# EAGLE design MINI_SAM_D51_013 (EAGLE 9.1.1)
BUILD: 2018/01; DESIGNER: BENJAMIN SHOCKLEY; REV: A
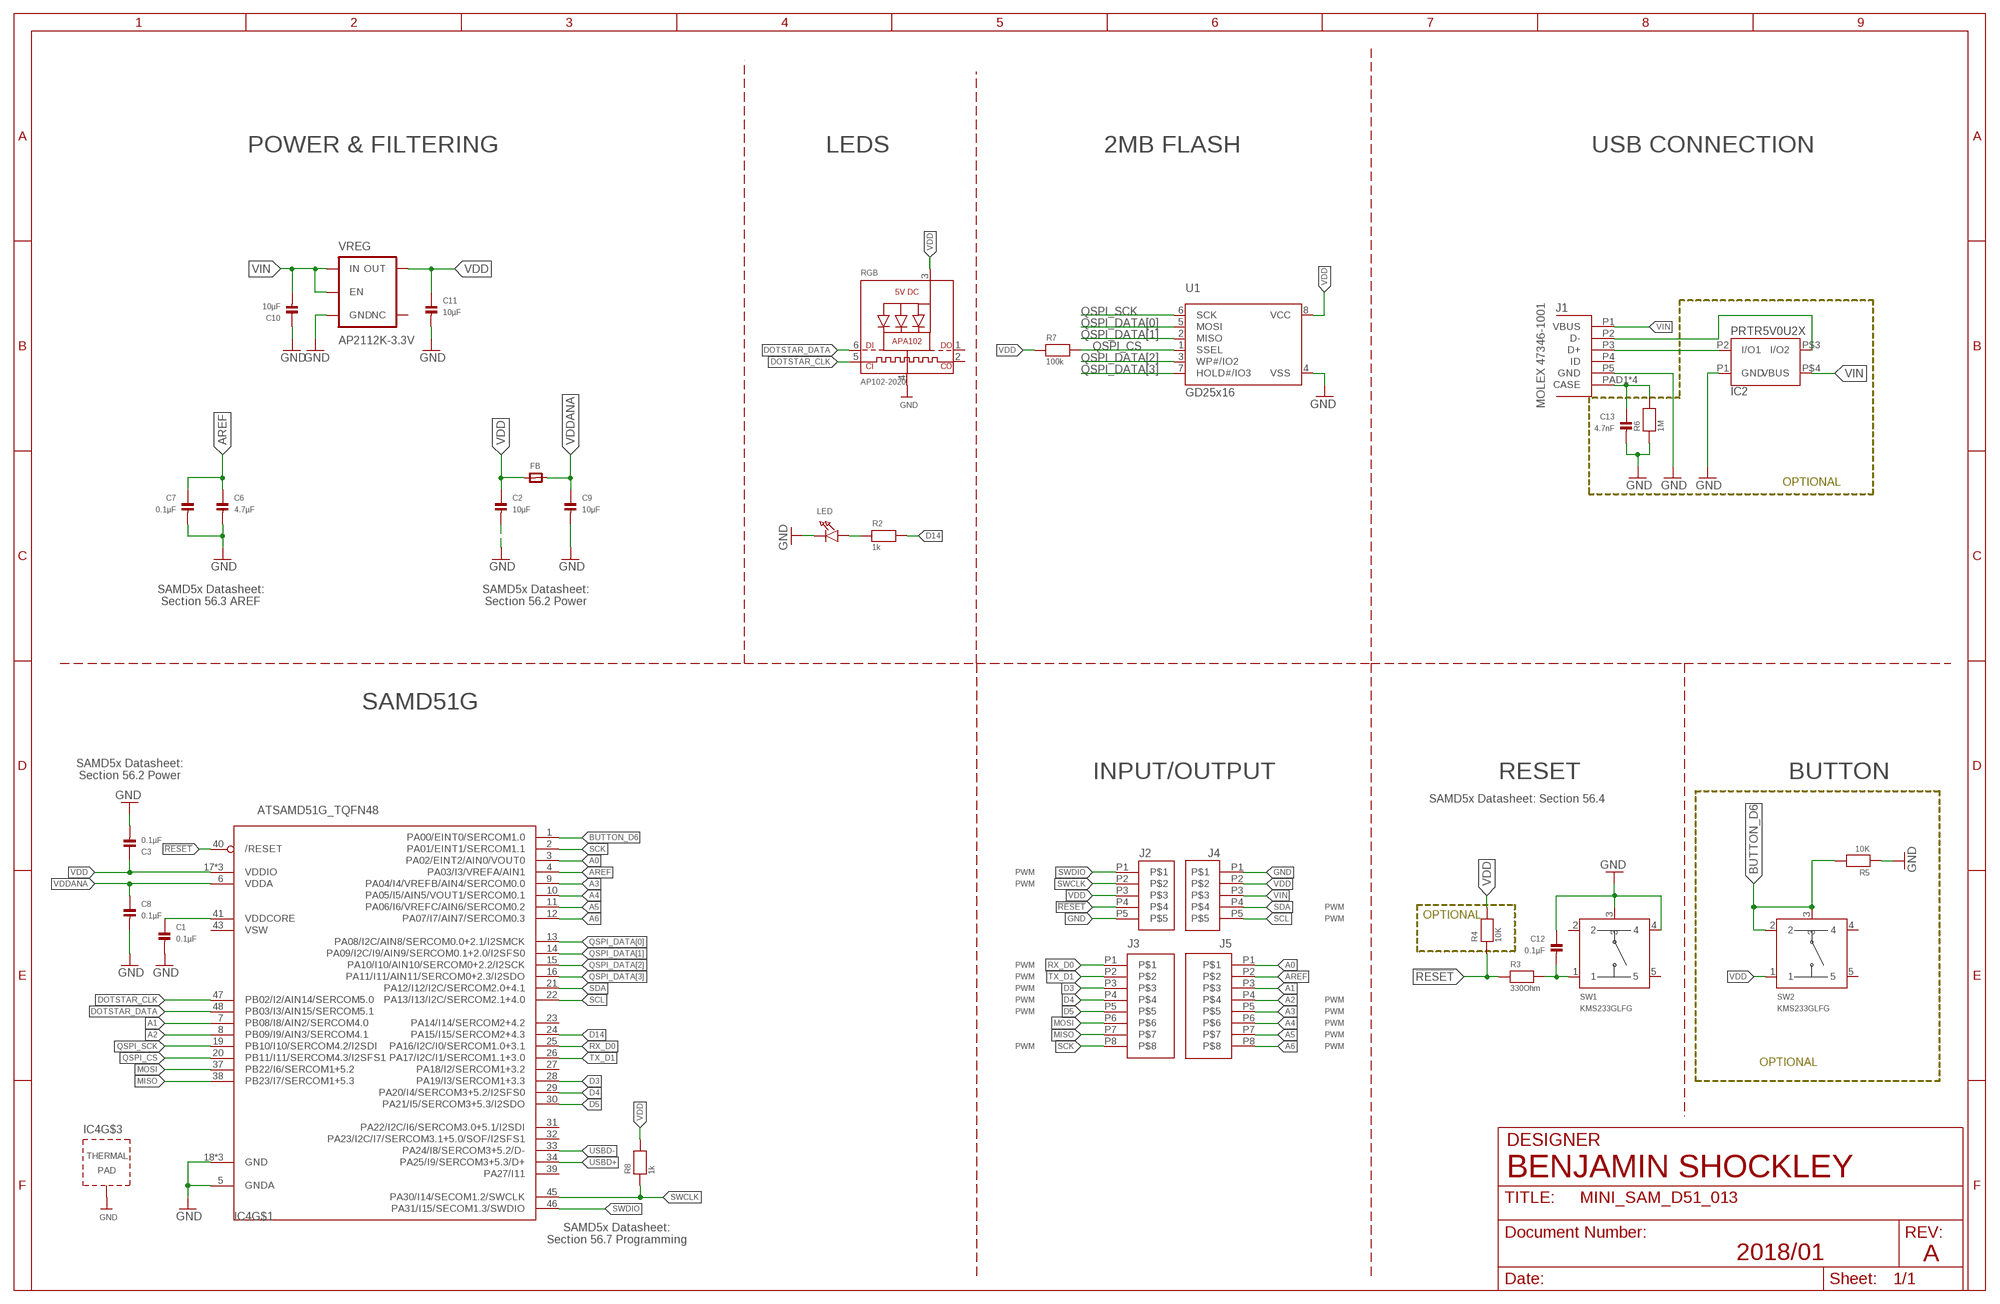
[diagram p0: schematic, sheet 1]

## Parts
C1  0.1µF  CAP_CERAMIC_0603MP  [_0603MP]
C2  10µF  CAP_CERAMIC_0603MP  [_0603MP]
C3  0.1µF  CAP_CERAMIC_0603MP  [_0603MP]
C6  4.7µF  CAP_CERAMIC_0603MP  [_0603MP]
C7  0.1µF  CAP_CERAMIC_0603MP  [_0603MP]
C8  0.1µF  CAP_CERAMIC_0603MP  [_0603MP]
C9  10µF  CAP_CERAMIC_0603MP  [_0603MP]
C10  10µF  CAP_CERAMIC_0603MP  [_0603MP]
C11  10µF  CAP_CERAMIC_0603MP  [_0603MP]
C12  0.1µF  CAP_CERAMIC_0603MP  [_0603MP]
C13  4.7nF  CAP_CERAMIC_0603MP  [_0603MP]
FB  FERRITE_0603MP  [_0603MP]
IC2  PRTR5V0U2X  [SOT143B_REFLOW]
IC4  ATSAMD51G_TQFN48  [TQFN48_7MM]
J1  MOLEX_47346-100147346  [MOLEX_47346-1001]
J2  1X5_HEADER_1.27MMCAST  [1X5_HEADER_1.27MM_CASTELLATED]
J3  1X8_HEADER_1.27MMCAST  [1X8_HEADER_1.27MM_CASTELLATED]
J4  1X5_HEADER_1.27MMCAST  [1X5_HEADER_1.27MM_CASTELLATED]
J5  1X8_HEADER_1.27MMCAST  [1X8_HEADER_1.27MM_CASTELLATED]
LED  LED0805_NOOUTLINE  [CHIPLED_0805_NOOUTLINE]
R2  1k  RESISTOR_0603MP  [_0603MP]
R3  330Ohm  RESISTOR_0603MP  [_0603MP]
R4  10K  RESISTOR_0603MP  [_0603MP]
R5  10K  RESISTOR_0603MP  [_0603MP]
R6  1M  RESISTOR_0603MP  [_0603MP]
R7  100k  RESISTOR_0603MP  [_0603MP]
R8  1k  RESISTOR_0603MP  [_0603MP]
RGB  AP102-2020  APA1022020  [APA102_2020]
SW1  KMS233GLFG  KMS_SWITCHKMS  [KMS_SWITCH]
SW2  KMS233GLFG  KMS_SWITCHKMS  [KMS_SWITCH]
U1  GD25x16  SPIFLASH_8PINUX  [USON8]
VREG  AP2112K-3.3V  V_REG_AP2112K-3.3V  [SOT23-5]

## Nets
!RESET: IC4.40(/RESET) J2.P4 R3.1 R4.1
A0: IC4.3(PA02/EINT2/AIN0/VOUT0) J5.P1
A1: IC4.7(PB08/I8/AIN2/SERCOM4.0) J5.P3
A2: IC4.8(PB09/I9/AIN3/SERCOM4.1) J5.P4
A3: IC4.9(PA04/I4/VREFB/AIN4/SERCOM0.0) J5.P5
A4: IC4.10(PA05/I5/AIN5/VOUT1/SERCOM0.1) J5.P6
A5: IC4.11(PA06/I6/VREFC/AIN6/SERCOM0.2) J5.P7
A6: IC4.12(PA07/I7/AIN7/SERCOM0.3) J5.P8
AREF: C6.1 C7.1 IC4.4(PA03/I3/VREFA/AIN1) J5.P2
BUTTON_D6: IC4.1(PA00/EINT0/SERCOM1.0) R5.2 SW2.2 SW2.3
D3: IC4.28(PA19/I3/SERCOM1+3.3) J3.P3
D4: IC4.29(PA20/I4/SERCOM3+5.2/I2SFS0) J3.P4
D5: IC4.30(PA21/I5/SERCOM3+5.3/I2SDO) J3.P5
D14: IC4.24(PA15/I15/SERCOM2+4.3) R2.2
DOTSTAR_CLK: IC4.47(PB02/I2/AIN14/SERCOM5.0) RGB.5(CKI)
DOTSTAR_DATA: IC4.48(PB03/I3/AIN15/SERCOM5.1) RGB.6(DI)
GND: C1.2 C2.2 C3.2 C6.2 C7.2 C8.2 C9.2 C10.1 C11.2 C12.1 C13.2 IC2.P1(GND) IC4.5(GNDA) IC4.18(GND) IC4.35(GND) IC4.42(GND) IC4.THERMAL(TP) J1.P5(GND) J2.P5 J4.P1 LED.C R5.1 R6.1 RGB.4(GND) SW1.3 SW1.4 U1.4(VSS) VREG.2(GND)
MISO: IC4.38(PB23/I7/SERCOM1+5.3) J3.P7
MOSI: IC4.37(PB22/I6/SERCOM1+5.2) J3.P6
N$2: C13.1 J1.PAD1(CASE) J1.PAD2(CASE) J1.PAD3(CASE) J1.PAD4(CASE) R6.2
N$3: LED.A R2.1
N$4: C12.2 R3.2 SW1.1
N$9: C1.1 IC4.41(VDDCORE)
QSPI_CS: IC4.20(PB11/I11/SERCOM4.3/I2SFS1) R7.2 U1.1(SSEL)
QSPI_DATA[0]: IC4.13(PA08/I2C/AIN8/SERCOM0.0+2.1/I2SMCK) U1.5(MOSI)
QSPI_DATA[1]: IC4.14(PA09/I2C/I9/AIN9/SERCOM0.1+2.0/I2SFS0) U1.2(MISO)
QSPI_DATA[2]: IC4.15(PA10/I10/AIN10/SERCOM0+2.2/I2SCK) U1.3(WP#/IO2)
QSPI_DATA[3]: IC4.16(PA11/I11/AIN11/SERCOM0+2.3/I2SDO) U1.7(HOLD#/IO3)
QSPI_SCK: IC4.19(PB10/I10/SERCOM4.2/I2SDI) U1.6(SCK)
RX_D0: IC4.25(PA16/I2C/I0/SERCOM1.0+3.1) J3.P1
SCK: IC4.2(PA01/EINT1/SERCOM1.1) J3.P8
SCL: IC4.22(PA13/I13/I2C/SERCOM2.1+4.0) J4.P5
SDA: IC4.21(PA12/I12/I2C/SERCOM2.0+4.1) J4.P4
SWCLK: IC4.45(PA30/I14/SECOM1.2/SWCLK) J2.P2 R8.1
SWDIO: IC4.46(PA31/I15/SECOM1.3/SWDIO) J2.P1
TX_D1: IC4.26(PA17/I2C/I1/SERCOM1.1+3.0) J3.P2
USBD+ [USB_DATA]: IC2.P2(I/O1) IC4.34(PA25/I9/SERCOM3+5.3/D+) J1.P3(D+)
USBD- [USB_DATA]: IC2.P$3(I/O2) IC4.33(PA24/I8/SERCOM3+5.2/D-) J1.P2(D-)
VDD: C2.1 C3.1 C11.1 FB.1 IC4.17(VDDIO) IC4.36(VDDIO) IC4.44(VDDIO) J2.P3 J4.P2 R4.2 R7.1 R8.2 RGB.3(VDD) SW2.1 U1.8(VCC) VREG.5(OUT)
VDDANA: C8.1 C9.1 FB.2 IC4.6(VDDA)
VIN: C10.2 IC2.P$4(VBUS) J1.P1(VBUS) J4.P3 VREG.1(IN) VREG.3(EN)
Unconnected: IC4.23(PA14/I14/SERCOM2+4.2) IC4.27(PA18/I2/SERCOM1+3.2) IC4.31(PA22/I2C/I6/SERCOM3.0+5.1/I2SDI) IC4.32(PA23/I2C/I7/SERCOM3.1+5.0/SOF/I2SFS1) IC4.39(PA27/I11) J1.P4(ID) RGB.1(DO) RGB.2(CKO) SW1.2 SW1.5 SW2.4 SW2.5 VREG.4(NC)

## Notes on the sheet
- POWER & FILTERING | LEDS | 2MB FLASH | USB CONNECTION
- MOLEX 47346-1001
- OPTIONAL
- SAMD5x Datasheet:
  Section 56.3 AREF
- SAMD5x Datasheet:
  Section 56.2 Power
- SAMD51G
- SAMD5x Datasheet:
  Section 56.2 Power
- INPUT/OUTPUT | RESET | BUTTON
- SAMD5x Datasheet: Section 56.4
- SPI:
   SERCOM1  SCK.1, MOSI.2, MISO.3
  
  I2C:
   SERCOM2  SDA.0, SCL.1
  
  UART:
   SERCOM3  TX.0, RX.1
- PWM
- PWM
- PWM
- OPTIONAL
- PWM
- PWM
- PWM
- PWM
- PWM | PWM
- PWM | PWM
- PWM
- PWM
- PWM | PWM
- OPTIONAL
- DESIGNER
- SAMD5x Datasheet:
  Section 56.7 Programming

## Power pins joined to a net without a drawn wire
VSW: IC4.43(VSW)

## Library data of the parts
C1-C3 C6-C13 = microbuilder:CAP_CERAMIC: Ceramic Capacitors 0402 - 0402 Surface Mount Capacitors 16pF 50V 5% [Digikey: 445-4899-2-ND] 18pF 50V 5% [Digikey: 490-1281-2-ND] 22pF 50V 5% [Digikey: 490-1283-2-ND] 68pF 50V 5% [Digikey: 490-1289-2-ND] 0.1uF 10V 10% [Digikey: 490-1318-2-ND] 1.0uF 6.3V 10% [Digikey: 490-1320-2-ND] 0603 - 0603 Surface Mount Capacitors 16 pF 50V 5% [Digikey: 445-5051-2-ND] 22 pF 50V [Digikey: PCC220ACVTR-ND] 33 pF 50V 5% [Digikey: 490-1415-1-ND] 56pF 50V 5% [Digikey: 490-1421-1-ND] 220pF 50V 5% [Digikey: 445-1285-1-ND] 680 pF 50V 2200 pF 50V 5% C0G [Digikey: 445-1297-1-ND] 5600 pF 100V 5% X7R [Digikey: 478-3711-1-ND] 0.1 µF 25V 10% [Digikey: PCC2277TR-ND] 0.22 µF 16V 10% X7R [Digikey: 445-1318-1-ND] 1.0 µF 25V 10% [Digikey: 445-5146-2-ND] 0603 - RF Specific 3pF 250V +/-0.1pF RF [Digikey: 712-1347-1-ND] 18 pF 250V 5% [Digikey: 478-3505-1-ND or 712-1322-1-ND] 56 pF 250V 5% C0G RF [Digikey: 490-4867-1-ND] 68 pF 250V RF [Digikey: 490-4868-1-ND] 0805 - 0805 Surface Mount Capacitors 220 pF 250V 2% RF Ceramic Capacitor [Digikey: 712-1398-1-ND] 1000 pF 50V 2% NP0 Ceramic Capacitor [Digikey: 478-3760-1-ND] 0.1 µF 25V 10% Ceramic Capacitor [Digikey: PCC1828TR-ND] 1.0 µF 16V 10% Ceramic Capacitor[Digikey: 490-1691-2-ND] 10.0 µF 10V 10% Ceramic Capacitor[Digikey: 709-1228-1-ND] 10.0 uF 16V 10% Ceramic Capacitor [Digikey: 478-5165-2-ND] 47 uF 6.3V 20% Ceramic Capacitor [Digikey: 587-1779-1-ND or 399-5506-1-ND] 1206 - 1206 Surface Mount Capacitors 47uF 10V 20% Ceramic Capacitor [Digikey: 490-5528-1-ND or 399-5508-1-ND or 445-6010-1-ND] 100uF 6.3V -20%, +80% Y5V Ceramic Capacitor (Digikey: 490-4512-1-ND, Mouser: 81-GRM31CF50J107ZE1L)
FB = microbuilder:FERRITE: Ferrite Bead 0603 MMZ1608B121C - 120 Ohm @ 100MHz, 600mA, 0.15 Ohm DC Resistance - Digikey: 445-2164-1-ND BK1608HW121-T - 120 Ohm, 600mA Ferrite Chip - Digikey: 587-1876-2-ND 0805 HZ0805B272R-10 - 2.7K Ohm @ 100MHz, 200mA, 0.8 Ohm DC Resistance - Digikey: 240-2504-1-ND (see also Murata BLM21BD272SN1L) MMZ2012Y152B - 1.5K Ohm @ 100MHz, 500mA, 0.4 Ohm DC Resistance - Digikey: 445-1560-1-ND - Mainly for high frequency (80-400MHz) MMZ2012R102A - 1K Ohm @ 100MHz, 500mA, 0.3 Ohm DC Resistance - Digikey: 445-1555-2-ND - More general purpose (10-200MHz)
IC2 = Shockley_Custom:PRTR5V0U2X
IC4 = microbuilder:ATSAMD51G
J1 = Shockley_Custom:MOLEX_47346-1001
J2 J4 = Shockley_Custom:1X5_HEADER_1.27MM
J3 J5 = Shockley_Custom:1X8_HEADER_1.27MM
LED = microbuilder:LED: LED 0603 - 0603 Surface Mount Package 2mA: Green LED - Low Power (3.9mcd, 2ma, 1.7Vf) - Digikey: 475-2709-2-ND Orange LED - Low Power (9.8mcd, 2ma, 1.8Vf) - Digikey: 475-1194-2-ND Red LED - Low Power (5mcd, 2ma, 1.8Vf) - Digikey: 475-1195-2-ND Yellow LED - Low Power (7mcd, 2ma, 1.8Vf) - Digikey: 475-1196-2-ND 5mA: Blue LED - Low Power (17mcd, 5ma, 2.9Vf) - Digikey: LNJ937W8CRACT-ND 0805 - 0805 Surface Mount Package 2mA: Red LED (8.8mcd, 2mA, 1.8Vf, Clear) - Low Power [Digikey: 475-2510-1-ND] Green LED (5mcd, 2mA, 1.8Vf, Clear) - Low Power [Digikey: 475-2730-1-ND] Yellow LED (11.3mcd, 2mA, 1.8Vf, Clear) - Low Power [Digikey: 475-2555-1-ND] 20mA: Red LED (104mcd, 20mA, Diffused) - LS R976 [Digikey: 475-1278-6-ND] Red LED (12mcd, 20mA, 2.0Vf, Clear) - APT2012EC [Digikey: 754-1128-1-ND] Green LED (15mcd, 20mA, 2.2Vf, Clear) - APT2012GC [Digikey: 754-1131-1-ND] Orange LED (160mcd, 20mA, 2.1Vf, Clear) - APT2012SECK [Digikey: 754-1130-1-ND] 1206 - 1206 Surface Mount Package Green LED (26mcd, 20mA, Diffused) - LG N971 [Digikey: 475-1407-6-ND] Red LED (15mcd, 20mA, Diffused) - LH N974 [Digikey: 475-1416-6-ND]
R2-R8 = microbuilder:RESISTOR: Resistors 0402 - 0402 Surface Mount Package 22 Ohm 1% 1/16W [Digikey: 311-22.0LRTR-ND] 33 Ohm 5% 1/16W 1.0K 5% 1/16W 1.5K 5% 1/16W 2.0K 1% 1/16W 10.0K 1% 1/16W [Digikey: 311-10.0KLRTR-ND] 10.0K 5% 1/16W [Digikey: RMCF0402JT10K0TR-ND] 12.1K 1% 1/16W [Digikey: 311-22.0LRTR-ND] 100.0K 5% 1/16W 0603 - 0603 Surface Mount Package 0 Ohm 1/10 Watt 1% Resistor 15 Ohm 1/10 Watt 1% Resistor 33 Ohm 1/10 Watt 1% Resistor 49.9 Ohm 1/10 Watt 1% Resistor 100 Ohm 1/10 Watt 1% Resistor 150 Ohm 1/10 Watt 1% Resistor 240 Ohm 1/10 Watt 1% Resistor 390 Ohm 1/10 Watt 1% Resistor 560 Ohm 1/10 Watt 1% Resistor 680 Ohm 1/10 Watt 1% Resistor 750 Ohm 1/10 Watt 1% Resistor 1.0K Ohm 1/10 Watt 1% Resistor 1.5K Ohm 1/10 Watt 1% Resistor 2.0K Ohm 1/10 Watt 1% Resistor 2.2K Ohm 1/10 Watt 1% Resistor 3.3K Ohm 1/10 Watt 1% Resistor 4.7K Ohm 1/10 Watt 1% Resistor 10.0K Ohm 1/10 Watt 1% Resistor 12.0K Ohm 1/10 Watt 1% Resistor 12.1K Ohm 1/10 Watt 1% Resistor 20.0K Ohm 1/10 Watt 1% Resistor 33.0K Ohm 1/10 Watt 1% Resistor 100.0K Ohm 1/10 Watt 1% Resistor 0805 - 0805 Surface Mount Package 0 Ohm 1/8 Watt 1% Resistor 33 Ohm 1/8 Watt 1% Resistor 100 Ohm 1/8 Watt 1% Resistor 150 Ohm 1/8 Watt 1% Resistor 200 Ohm 1/8 Watt 1% Resistor 240 Ohm 1/8 Watt 1% Resistor 330 Ohm 1/8 Watt 1% Resistor 390 Ohm 1/8 Watt 1% Resistor 470 Ohm 1/8 Watt 1% Resistor 1.0K Ohm 1/8 Watt 1% Resistor 1.5K Ohm 1/8 Watt 1% Resistor 2.0K Ohm 1/8 Watt 1% Resistor 4.7K Ohm 1/8 Watt 1% Resistor 5.1K Ohm 1/8 Watt 1% Resistor 5.6K Ohm 1/8 Watt 1% Resistor 10.0K Ohm 1/8 Watt 1% Resistor 22.0K Ohm 1/8 Watt 1% Resistor 33.0K Ohm 1/8 Watt 1% Resistor 100K Ohm 1/8 Watt 1% Resistor 1206 - 1206 Surface Mount Package 2012 - 2010 Surface Mount Package 0.11 Ohm 1/2 Watt 1% Resistor - Digikey: RHM.11UCT-ND
RGB = microbuilder:APA102: APA102/DotStar Pixels VCC: 5V DC Refresh Rate: 400Hz
SW1 SW2 = Shockley_Custom:KMS_SWITCH
U1 = microbuilder:SPIFLASH_8PIN: SOIC8 SPI Flash Be careful with the size since SOIC8 flash comes in several 'widths' SOIC8 150 mil M25P16 - 16Mbit (2Mbit x 8) Serial Flash (75MHz SPI Bus), Supply: 2.7-3.6V Digikey: SOIC8 - M25P16-VMN6P-ND SOIC8 208 mil W25Q16BVSSIG - 16Mbit (2Mbit x 8) Serial Flash (104MHz SPI Bus), Supply: 2.7-3.6V Digikey: SOIC8 - W25Q16BVSSIG-ND
VREG = SparkFun-PowerIC:V_REG_AP2112: AP2112 - 600mA CMOS LDO Regulator w/ Enable The AP2112 is CMOS process low dropout linear regulator with enable function, the regulator delivers a guaranteed 600mA (min.) continuous load current. Features Output Voltage Accuracy: ±1.5% Output Current: 600mA (Min.) Foldback Short Current Protection: 50mA Enable Function to Turn ON/OFF VOUT Low Dropout Voltage (3.3V): 250mV (Typ.) @IOUT=600mA Excellent Load Regulation: 0.2%/A (Typ.) Excellent Line Regulation: 0.02%/V (Typ.) Low Quiescent Current: 55μA (Typ.) Low Standby Current: 0.01μA (Typ.) Low Output Noise: 50μVRMS PSRR: 100Hz -65dB, 1kHz -65dB OTSD Protection Stable with 1.0μF Flexible Cap: Ceramic, Tantalum and Aluminum Electrolytic Operation Temperature Range: -40°C to 85°C ESD: MM 400V, HBM 4000V; PROD_ID: VREG-12457; VALUE: 3.3V

## Board
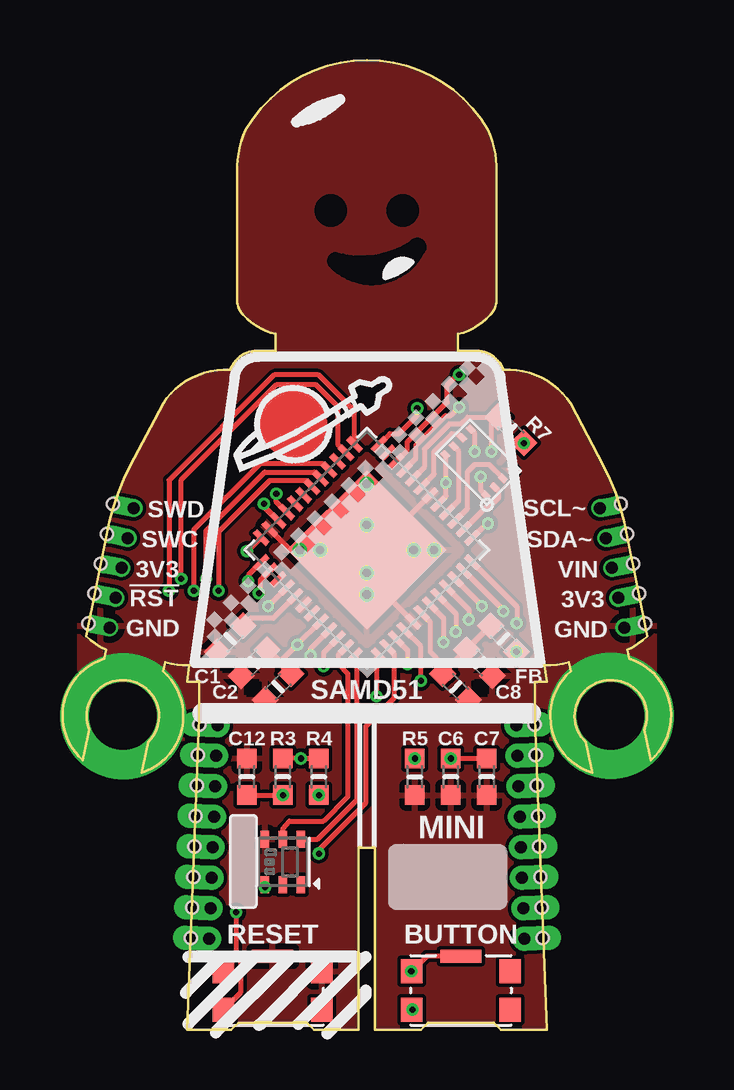
[diagram p1: board, top side]
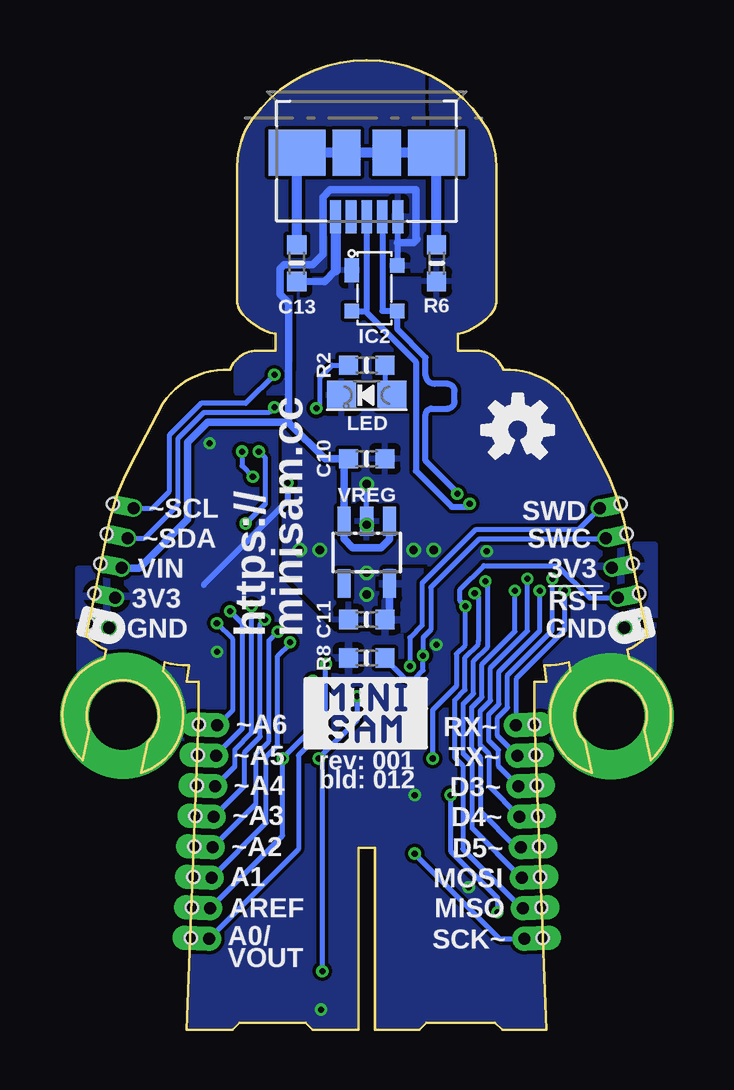
[diagram p2: board, bottom side, seen from below]

Size 25.38 x 40.42 mm. Coordinates in mm from the lower left corner, seen from the top.
Outline: 7.54,29.8 arc-40 7.29,30.3
Outline: 7.29,30.3 7.29,36
Outline: 18.09,30.3 18.09,36
Outline: 7.64,37.5 arc-120 17.74,37.5
Outline: 7.29,36 arc-25 7.64,37.5
Outline: 18.09,36 arc25 17.74,37.5
Outline: 7.54,29.8 arc35 8.89,29
Outline: 17.84,29.8 arc40 18.09,30.3
Outline: 17.84,29.8 arc-35 16.49,29
Outline: 8.01,28.3 arc63 6.99,27.5
Outline: 18.39,27.5 arc63 17.37,28.3
Outline: 6.99,27.5 arc60 4.19,26.1 2.82,23.5 arc18 1.83,20.54 0.99,16.4 arc15 1.82,15.83 1.75,15.46 arc122 0.85,11.24 1.12,12.52 arc-125 2.83,14.54 arc-125 3.56,12
Outline: 18.39,27.5 arc-60 21.19,26.1 22.55,23.5 arc-18 23.55,20.54 24.39,16.4 arc-15 23.55,15.83 23.63,15.46 arc-122 24.53,11.24 24.26,12.52 arc125 22.55,14.54 arc125 21.81,12 22.08,10.72 arc-122 21.19,14.95 21.11,15.31 arc-15 20.09,15.2 20.19,14.5 19.69,14.5 19.69,13 20.19,0 18.29,0 17.99,0.3 15.24,0.3 14.94,0 13.04,0 13.04,7.6 12.34,7.6 12.34,0 10.49,0 10.19,0.3 7.34,0.3 7.04,0 5.19,0 5.69,13 5.69,14.5 5.19,14.5 5.29,15.2 arc-15 4.27,15.31 4.19,14.95 arc-122 3.29,10.72
Outline: 3.56,12 3.29,10.72
Outline: 3.56,12 3.29,10.72
Outline: 8.01,28.3 8.69,28.3 8.89,28.3 8.89,29
Outline: 8.01,28.3 arc63 6.99,27.5
Outline: 18.39,27.5 arc63 17.37,28.3
Outline: 17.37,28.3 16.69,28.3 16.49,28.3 16.49,29
Outline: 7.54,29.8 arc-40 7.29,30.3
Outline: 7.29,30.3 7.29,36
Outline: 18.09,30.3 18.09,36
Outline: 7.64,37.5 arc-120 17.74,37.5
Outline: 7.29,36 arc-25 7.64,37.5
Outline: 18.09,36 arc25 17.74,37.5
Outline: 7.54,29.8 arc35 8.89,29
Outline: 17.84,29.8 arc40 18.09,30.3
Outline: 17.84,29.8 arc-35 16.49,29
Copper layers (1*16): Top 0.035559375mm / dielectric 1.6mm / Bottom 0.035559375mm
Design rules "oshpark-2layer-tented *": minimum track width 6mil, minimum drill 10mil, track to track 6mil, track to pad 6mil, pad to pad 6mil, via to via 6mil, smd to smd 6mil, copper to edge 0.5mil, drill to drill 6mil, minimum pad ring 5mil, minimum via ring 5mil, stop-mask expansion 2.5mil, vias tented up to drill 20mil, thermal gap 10mil
tRestrict: area 11.1,31.2 to 15,32.9; area 10.9,33.9 to 11.5,34.4; area 13.9,33.9 to 14.5,34.4; area 12.2,25.9 to 13.4,26.9; area 13.3,26.8 to 13.4,26.9; 5 lines
bRestrict: area 12.3,25.8 to 13.1,27.1

### Footprints (pad centres in the part's own frame; a part is rotated, then mirrored left to right if it is on the bottom)
_0603MP = smd 0.8 x 0.8: 1 -0.762,0; 2 0.762,0
SOT143B_REFLOW = smd 1 x 0.6: P1 -0.75,-0.95 | smd 0.6 x 0.6: P2 0.95,-0.95; P$3 0.95,0.95; P$4 -0.95,0.95
TQFN48_7MM = smd 0.25 x 0.75: 1 -2.75,-3.475; 2 -2.25,-3.475; 3 -1.75,-3.475; 4 -1.25,-3.475; 5 -0.75,-3.475; 6 -0.25,-3.475; 7 0.25,-3.475; 8 0.75,-3.475; 9 1.25,-3.475; 10 1.75,-3.475; 11 2.25,-3.475; 12 2.75,-3.475; 25 2.75,3.475; 26 2.25,3.475; 27 1.75,3.475; 28 1.25,3.475; 29 0.75,3.475; 30 0.25,3.475; 31 -0.25,3.475; 32 -0.75,3.475; 33 -1.25,3.475; 34 -1.75,3.475; 35 -2.25,3.475; 36 -2.75,3.475 | smd 0.75 x 0.25: 13 3.475,-2.75; 14 3.475,-2.25; 15 3.475,-1.75; 16 3.475,-1.25; 17 3.475,-0.75; 18 3.475,-0.25; 19 3.475,0.25; 20 3.475,0.75; 21 3.475,1.25; 22 3.475,1.75; 23 3.475,2.25; 24 3.475,2.75; 37 -3.475,2.75; 38 -3.475,2.25; 39 -3.475,1.75; 40 -3.475,1.25; 41 -3.475,0.75; 42 -3.475,0.25; 43 -3.475,-0.25; 44 -3.475,-0.75; 45 -3.475,-1.25; 46 -3.475,-1.75; 47 -3.475,-2.25; 48 -3.475,-2.75 | smd 4.7 x 4.7: THERMAL 0,0
MOLEX_47346-1001 = smd 0.45 x 1.38: P1 1.3,-2.66; P2 0.65,-2.66; P3 0,-2.66; P4 -0.65,-2.66; P5 -1.3,-2.66 | smd 2.375 x 1.9: PAD1 -2.913,0; PAD4 2.913,0 | smd 1.175 x 1.9: PAD2 -0.838,0; PAD3 0.838,0
1X5_HEADER_1.27MM_CASTELLATED = drill 0.5 offset: P1 -2.54,0; P2 -1.27,0; P3 0,0; P4 1.27,0; P5 2.54,0 | hole 0.5: -2.54,-0.889; -1.27,-0.889; 0,-0.889; 1.27,-0.889; 2.54,-0.889
1X8_HEADER_1.27MM_CASTELLATED = drill 0.5 pad 1.016 offset: P1 -4.445,0; P2 -3.175,0; P3 -1.905,0; P4 -0.635,0; P5 0.635,0; P6 1.905,0; P7 3.175,0; P8 4.445,0 | hole 0.5: -4.445,-0.762; -1.905,-0.762; -0.635,-0.762; 0.635,-0.762; 1.905,-0.762; 3.175,-0.762; 4.445,-0.762; -4.445,-0.762; -3.175,-0.762
CHIPLED_0805_NOOUTLINE = smd 1.2 x 1.2: A 0,-1.05; C 0,1.05
APA102_2020 = smd 0.7 x 0.35: 1 -0.95,-0.75; 2 -0.95,0; 3 -0.95,0.75; 4 0.95,0.75; 5 0.95,0; 6 0.95,-0.75
KMS_SWITCH = smd 0.9 x 1: 1 -2.05,-0.8; 2 -2.05,0.8; 4 2.05,0.8; 5 2.05,-0.8 | smd 1.7 x 0.55: 3 0,1.425
USON8 = smd 0.35 x 0.25: 1 -1.2,0.75; 2 -1.2,0.25; 3 -1.2,-0.25; 4 -1.2,-0.75; 5 1.2,-0.75; 6 1.2,-0.25; 7 1.2,0.25; 8 1.2,0.75
SOT23-5 = smd 0.55 x 1.2: 1 -0.95,-1.3; 2 0,-1.3; 3 0.95,-1.3; 4 0.95,1.3; 5 -0.95,1.3

### Placement (x,y rotation side)
C1  6.99,16.3 225 top
C2  7.99,15.3 225 top
C3  8.99,14.3 225 top
C6  16.19,10.55 270 top
C7  17.69,10.55 270 top
C8  17.39,15.3 315 top
C9  16.39,14.3 315 top
C10  12.69,23.8 180 bottom
C11  12.69,17.1 180 bottom
C12  7.69,10.55 270 top
C13  15.6,31.95 270 bottom
FB  18.39,16.3 135 top
IC2  12.36,30.9 270 bottom
IC4  12.69,20 45 top
J1  12.69,36.55 0 bottom
J2  2.46,19.25 258.5 top
J3  6.29,8.25 267.8 top
J4  22.91,19.25 101.5 top
J5  19.09,8.25 92.2 top
LED  12.69,26.45 90 bottom
R2  12.69,27.7 180 bottom
R3  9.19,10.55 270 top
R4  10.69,10.55 270 top
R5  14.69,10.55 90 top
R6  9.78,31.95 90 bottom
R7  18.69,25 135 top
R8  12.69,15.5 180 bottom
RGB  9.19,7 90 top
SW1  8.76,1.65 0 top
SW2  16.61,1.65 0 top
U1  17.34,23.65 135 top
U$3  [OSHW-LOGO-S]  6.39,25 0 bottom
VREG  12.69,19.9 180 bottom

### Tracks (layer width: path | path; a pad name or v marks a point on that pad's centre or on a via)
!RESET  (via drill 0.25)
  Top 0.203: IC4.40 v8.57,17.65 | R4.1 v9.94,11.31 R3.1
  Bottom 0.203: v9.94,11.31 9.94,13.32 8.95,14.31 8.95,15.67 8.58,16.04 8.58,16.14 8.58,17.64 v8.57,17.65 8.8,17.88 8.8,18.36 7.81,19.35 4.74,19.35 3.39,18 J2.P4
A0  (via drill 0.25)
  Top 0.203: IC4.3 14.39,15.82 v14.39,15.25
  Bottom 0.203: J5.P1 15.55,7.51 15.53,7.54 15.53,11.44 14.43,12.54 14.43,15.21 v14.39,15.25
A1  (via drill 0.25)
  Top 0.203: IC4.7 15.89,17.15 v15.89,16.15
  Bottom 0.203: v15.89,16.15 15.89,16.1 16.4,15.59 16.4,11.87 16.88,11.39 16.88,8.63 J5.P3
A2  (via drill 0.25)
  Top 0.203: IC4.8 16.4,17.35 v16.4,16.59
  Bottom 0.203: v16.4,16.59 16.77,16.22 16.77,12.04 17.3,11.5 17.3,9.42 J5.P4
A3  (via drill 0.25)
  Top 0.203: IC4.9 16.94,17.52 v16.94,17.1
  Bottom 0.203: v16.94,17.1 17.13,16.91 17.13,12.22 17.78,11.57 17.78,10.17 J5.P5
A4  (via drill 0.25)
  Top 0.203: IC4.10 17.49,17.68 v17.49,17.65
  Bottom 0.203: v17.49,17.65 17.49,12.38 18.19,11.68 18.19,10.98 J5.P6
A5  (via drill 0.25)
  Top 0.203: IC4.11 18.39,17.48 v18.39,17.45
  Bottom 0.203: J5.P7 18.97,11.47 17.87,12.57 17.87,16.93 v18.39,17.45
A6  (via drill 0.25)
  Top 0.203: IC4.12 18.94,17.64 v18.94,16.95
  Bottom 0.203: v18.94,16.95 18.27,16.28 18.27,13.34 J5.P8
AREF  (via drill 0.25)
  Top 0.203: C6.1 C7.1 | v14.94,14.55 14.94,15.98 IC4.4
  Bottom 0.203: J5.P2 16.19,8.1 C6.1 14.94,12.56 v14.94,14.55
  other vias: 16.19,11.31
BUTTON_D6  (via drill 0.25)
  Top 0.203: v13.09,13.9 13.09,15.49 IC4.1 | SW2.3 15.19,3.08 SW2.2 v14.54,2.45
  Bottom 0.203: v13.09,13.9 13.09,13.05 13.09,12.91 R5.2 14.54,11.16 v14.54,2.45
  other vias: 14.69,11.31
D3  (via drill 0.25)
  Top 0.203: IC4.28 10.86,23.6 8.23,23.6 5.48,20.84 v5.48,18.3 | IC4.28
  Bottom 0.203: J3.P3 7.2,10.99 7.2,11.65 7.59,12.05 7.59,13.15 7.17,13.58 7.17,14.94 5.48,16.63 v5.48,18.3
D4  (via drill 0.25)
  Top 0.203: IC4.29 10.51,23.24 8.43,23.24 5.98,20.8 v5.98,18.8 | IC4.29
  Bottom 0.203: J3.P4 7.58,10.15 7.58,11.48 7.95,11.86 7.95,13.3 7.53,13.72 7.53,15.08 5.98,16.62 v5.98,18.8
D5  (via drill 0.25)
  Top 0.203: IC4.30 10.15,22.89 8.63,22.89 6.5,20.77 v6.5,18.3 | IC4.30
  Bottom 0.203: v6.5,18.3 6.5,16.61 7.88,15.23 7.88,13.87 8.31,13.45 8.31,11.71 7.93,11.34 7.93,9.08 6.46,7.62 J3.P5
D14  (via drill 0.25)
  Top 0.203: IC4.24 13.65,24.85 14.04,24.85 14.79,25.6 v14.79,25.9
  Bottom 0.203: R2.2 14.14,27.7 14.64,27.2 14.64,26.05 v14.79,25.9
DOTSTAR_CLK
  Top 0.203: RGB.5 9.19,8.39 9.47,8.7 10.87,8.7 11.89,9.71 11.89,14.85 11.49,15.25 11.49,15.62 IC4.47
DOTSTAR_DATA
  Top 0.203: RGB.6 10.63,7.95 12.28,9.6 12.28,15.5 IC4.48
GND  (via drill 0.35, 2.8 pad 5.25)
  Top 0.203: IC4.5 13.04,18.59 13.04,19.15 | 13.04,19.65 13.04,20 | IC4.18 13.04,20 | 13.04,20 IC4.THERMAL | IC4.35 10.36,19.15 13.04,19.15 | IC4.THERMAL 13.04,19.65 | 13.04,19.65 13.04,19.15 | IC4.THERMAL v12.69,18.15
  Bottom 0.203: VREG.2 v12.69,22.75
  Bottom 0.305: C13.2 14.45,31.18 13.99,31.65
  Bottom 0.406: J1.P5 13.99,31.65
  other vias: 2.52,13.08 22.85,13.09 12.69,21.05 15.49,20 9.89,20 14.64,20 10.74,20 12.69,19.05
  pour Top (rank 2): 5.19,0 20.19,0 20.19,12 21.69,12 21.69,14 22.69,14 22.69,12 24.69,12 24.69,40.35 0.69,40.35 0.69,12 2.69,12 2.69,14 3.69,14 3.69,12 5.19,12
  pour Bottom (rank 2): 10.39,40.25 10.39,32 15.54,32 15.54,27.35 24.69,27.35 24.69,12 20.19,12 20.19,0 5.19,0 5.19,12 3.69,12 3.69,14 2.69,14 2.69,12 0.69,12 0.69,40.25
MISO  (via drill 0.25)
  Top 0.203: IC4.38 8.25,18.74 8.25,18.26 v8.19,18.2
  Bottom 0.203: J3.P7 6.19,5.05 8.68,7.54 8.68,11.01 9.02,11.35 9.02,13.74 8.59,14.17 8.59,15.52 8.04,16.08 8.04,16.2 8.04,18.05 v8.19,18.2
MOSI  (via drill 0.25)
  Top 0.203: IC4.37 7.74,18.94 v7.74,18.7
  Bottom 0.203: J3.P6 6.23,6.35 8.29,8.4 8.29,11.13 8.66,11.51 8.66,13.6 8.24,14.02 8.24,15.38 7.64,15.98 7.64,18.6 v7.74,18.7
N$2
  Bottom 0.406: R6.2 J1.PAD4 J1.PAD3 J1.PAD2 J1.PAD1 C13.1
N$3
  Bottom 0.203: R2.1 11.93,26.74 LED.A
N$4  (via drill 0.25)
  Top 0.203: v7.24,4.9 7.24,3.23 7.42,3.06 7.42,1.55 SW1.1 | C12.2 R3.2
  Bottom 0.203: R3.2 9.19,7.45 7.24,5.5 v7.24,4.9
  other vias: 9.19,9.79
N$9
  Top 0.203: IC4.41 9.08,17.45 9.08,17.44 8.78,17.15 8.36,17.15 7.84,17.15 C1.1
QSPI_CS  (via drill 0.25)
  Top 0.203: IC4.20 15.09,23.45 15.09,24.21 16.12,25.24 16.6,25.24 16.9,25.54 R7.2 17.89,25.28 v17.89,24.1 | U1.1 17.44,22.49 v17.44,23.05
  Bottom 0.203: v17.89,24.1 17.89,23.5 v17.44,23.05
QSPI_DATA[0]  (via drill 0.25)
  Top 0.203: v17.19,24.1 17.19,24.86 U1.5 | IC4.13 17.68,21.1 v17.74,21.1
  Bottom 0.203: v17.19,24.1 16.91,23.83 16.91,22.75 16.91,21.92 v17.74,21.1
QSPI_DATA[1]
  Top 0.203: IC4.14 17.67,21.8 17.79,21.8 18.19,22.19 18.19,22.45 U1.2
QSPI_DATA[2]
  Top 0.203: IC4.15 16.89,21.73 16.89,23.27 17.18,23.56 17.78,23.56 U1.3
QSPI_DATA[3]
  Top 0.203: IC4.16 16.53,22.07 16.53,22.75 16.53,24.11 U1.7
QSPI_SCK
  Top 0.203: IC4.19 15.49,23.16 15.49,24.11 16.24,24.85 16.49,24.85 U1.6
RX_D0  (via drill 0.25)
  Top 0.203: v4.44,18.3 4.44,22.91 8.83,27.3 10.68,27.3 12.18,25.8 IC4.25
  Bottom 0.203: v4.44,18.3 4.44,16.65 6.46,14.63 J3.P1
SCK  (via drill 0.25)
  Top 0.203: IC4.2 13.84,15.67 13.84,13.85 12.65,12.66 12.65,9.47 10.69,7.51 v10.69,7.35
  Bottom 0.203: v10.69,7.35 7.15,3.81 J3.P8
SCL  (via drill 0.25)
  Top 0.203: IC4.22 14.38,24.16 14.38,24.5 16.03,26.15 16.03,26.86 16.47,27.3 v16.54,27.3
  Bottom 0.203: v16.54,27.3 17.73,26.11 19.6,26.11 20.91,24.8 20.91,22.45 21.62,21.74 J4.P5
SDA  (via drill 0.25)
  Top 0.203: IC4.21 14.73,23.81 14.73,24.35 15.98,25.6 16.19,25.6 v16.54,25.95
  Bottom 0.203: v16.54,25.95 16.77,25.72 19.48,25.72 20.55,24.65 20.55,21.89 21.95,20.5 J4.P4
SWCLK  (via drill 0.25)
  Top 0.203: IC4.45 10.45,15.99 10.34,15.88 v10.34,15.6
  Bottom 0.203: J2.P2 2.75,20.46 7.99,20.46 10.01,18.45 10.01,16.68 10.34,16.35 v10.34,15.6 10.34,14.98 10.68,14.64 11.1,14.64 11.93,15.47 R8.1
SWDIO  (via drill 0.25)
  Top 0.203: IC4.46 10.89,15.72 v10.89,15.15
  Bottom 0.203: J2.P1 3.86,20.85 8.16,20.84 10.38,18.62 10.38,16.86 10.89,16.35 v10.89,15.15
TX_D1  (via drill 0.25)
  Top 0.203: IC4.26 11.49,24.38 11.49,25.96 11.29,26.16 10.55,26.9 8.93,26.9 4.95,22.92 v4.95,18.8
  Bottom 0.203: J3.P2 7.24,12.25 7.24,13.01 6.81,13.43 6.81,14.79 4.95,16.65 v4.95,18.8
USBD+  (via drill 0.25)
  Top 0.254: IC4.34 8.34,21.87 v8.4,21.93
  Bottom 0.254: v8.4,21.93 8.53,21.8 9.14,21.8 10.64,23.29 10.64,27.85 12.69,29.9 | J1.P3 12.69,29.9 | IC2.P2 12.74,29.95 12.69,29.9
USBD-  (via drill 0.25)
  Top 0.203: IC4.33 8.91,22.01 v8.91,22.34
  Bottom 0.254: J1.P2 12.04,29.95 IC2.P$3 11.41,29.2 10.23,28.02 10.23,27.3 arc-90 9.86,26.93 9.34,26.93 arc90 9.02,26.61 9.02,26.21 arc90 9.34,25.89 9.97,25.89 arc-90 10.23,25.63 10.23,23.71 8.91,22.39 v8.91,22.34
VDD  (via drill 0.25)
  Top 0.203: v19.24,24.45 | R7.1 v19.24,24.45 | U1.8 15.99,23.94 v15.99,22.8 15.99,22.24 IC4.17 | SW2.1 v14.59,0.85 | IC4.36 7.72,19.95 v7.69,19.95 | IC4.44 v9.79,16.05 9.05,15.31
  Top 0.305: C2.1 9.05,15.31 C3.1 | RGB.3 v8.44,5.95
  Bottom 0.254: v15.99,22.8 15.99,22.05 19.49,18.55
  Bottom 0.305: VREG.5 11.74,17.29 C11.1
  other vias: 18.93,15.76 10.69,9.79
  pour Bottom: 0.69,0 0.69,20.2 7.74,20.2 8.84,19.1 12.04,19.1 12.04,16.45 14.1,16.45 16.54,18.89 16.54,25.15 20.24,25.15 20.24,21.1 22.14,19.2 24.69,19.2 24.69,-0.05 0.69,-0.05
VDDANA
  Top 0.203: IC4.6 15.34,17 15.34,15.75 15.85,15.24 C9.1
  Top 0.254: C9.1 C8.1 FB.2
VIN
  Bottom 0.254: J1.P1 11.41,33.87 11.41,32.8 IC2.P$4
  Bottom 0.305: 11.41,32.8 10.74,32.8 10.59,32.95 10.64,33 10.64,35 14.22,35 14.52,34.71 14.52,32.32 14.95,31.89 16.13,31.89 16.31,31.71 16.31,30.66 15.94,30.29 15.94,25.31 | VREG.1 11.74,20.45 12.09,20.1 13.28,20.1 13.64,20.46 VREG.3 13.64,23.61 C10.2 14.43,23.8 15.94,25.31 | 15.94,25.31 19.31,25.31 20.15,24.48 20.15,21.27 22.18,19.24 22.9,19.24 J4.P3
  pour Bottom: 10.39,40.3 10.33,31.65 15.89,31.65 15.92,26.55 18.09,26.55 18.09,40.3
(copper drawn outside any net)
  shapes: Top circle x1

### Text on the board
bPlace: SWD | ~SCL | SWC | ~SDA | 3V3 | VIN | !RST | 3V3 | GND | GND | RX~ | ~A6 | TX~ | ~A5 | D3~ | ~A4 | D4~ | ~A3 | D5~ | ~A2 | MOSI | A1 | MISO | AREF | SCK~ | A0/ / VOUT
tNames: SWD | SCL~ | SWC | SDA~ | 3V3 | VIN | !RST | 3V3 | GND | GND | SAMD51 | MINI | RESET | BUTTON
bNames: R2 | https:// / minisam.cc | rev: 001 / bld: 012
tStop: MEM | STATUS | SAM | D51
_tNames: L | L | C10 | C11
_bNames: IC2 | IC2